# EAGLE design v0.3.0 (EAGLE 9.2.0)

## Sheet 1 of 2: Interface
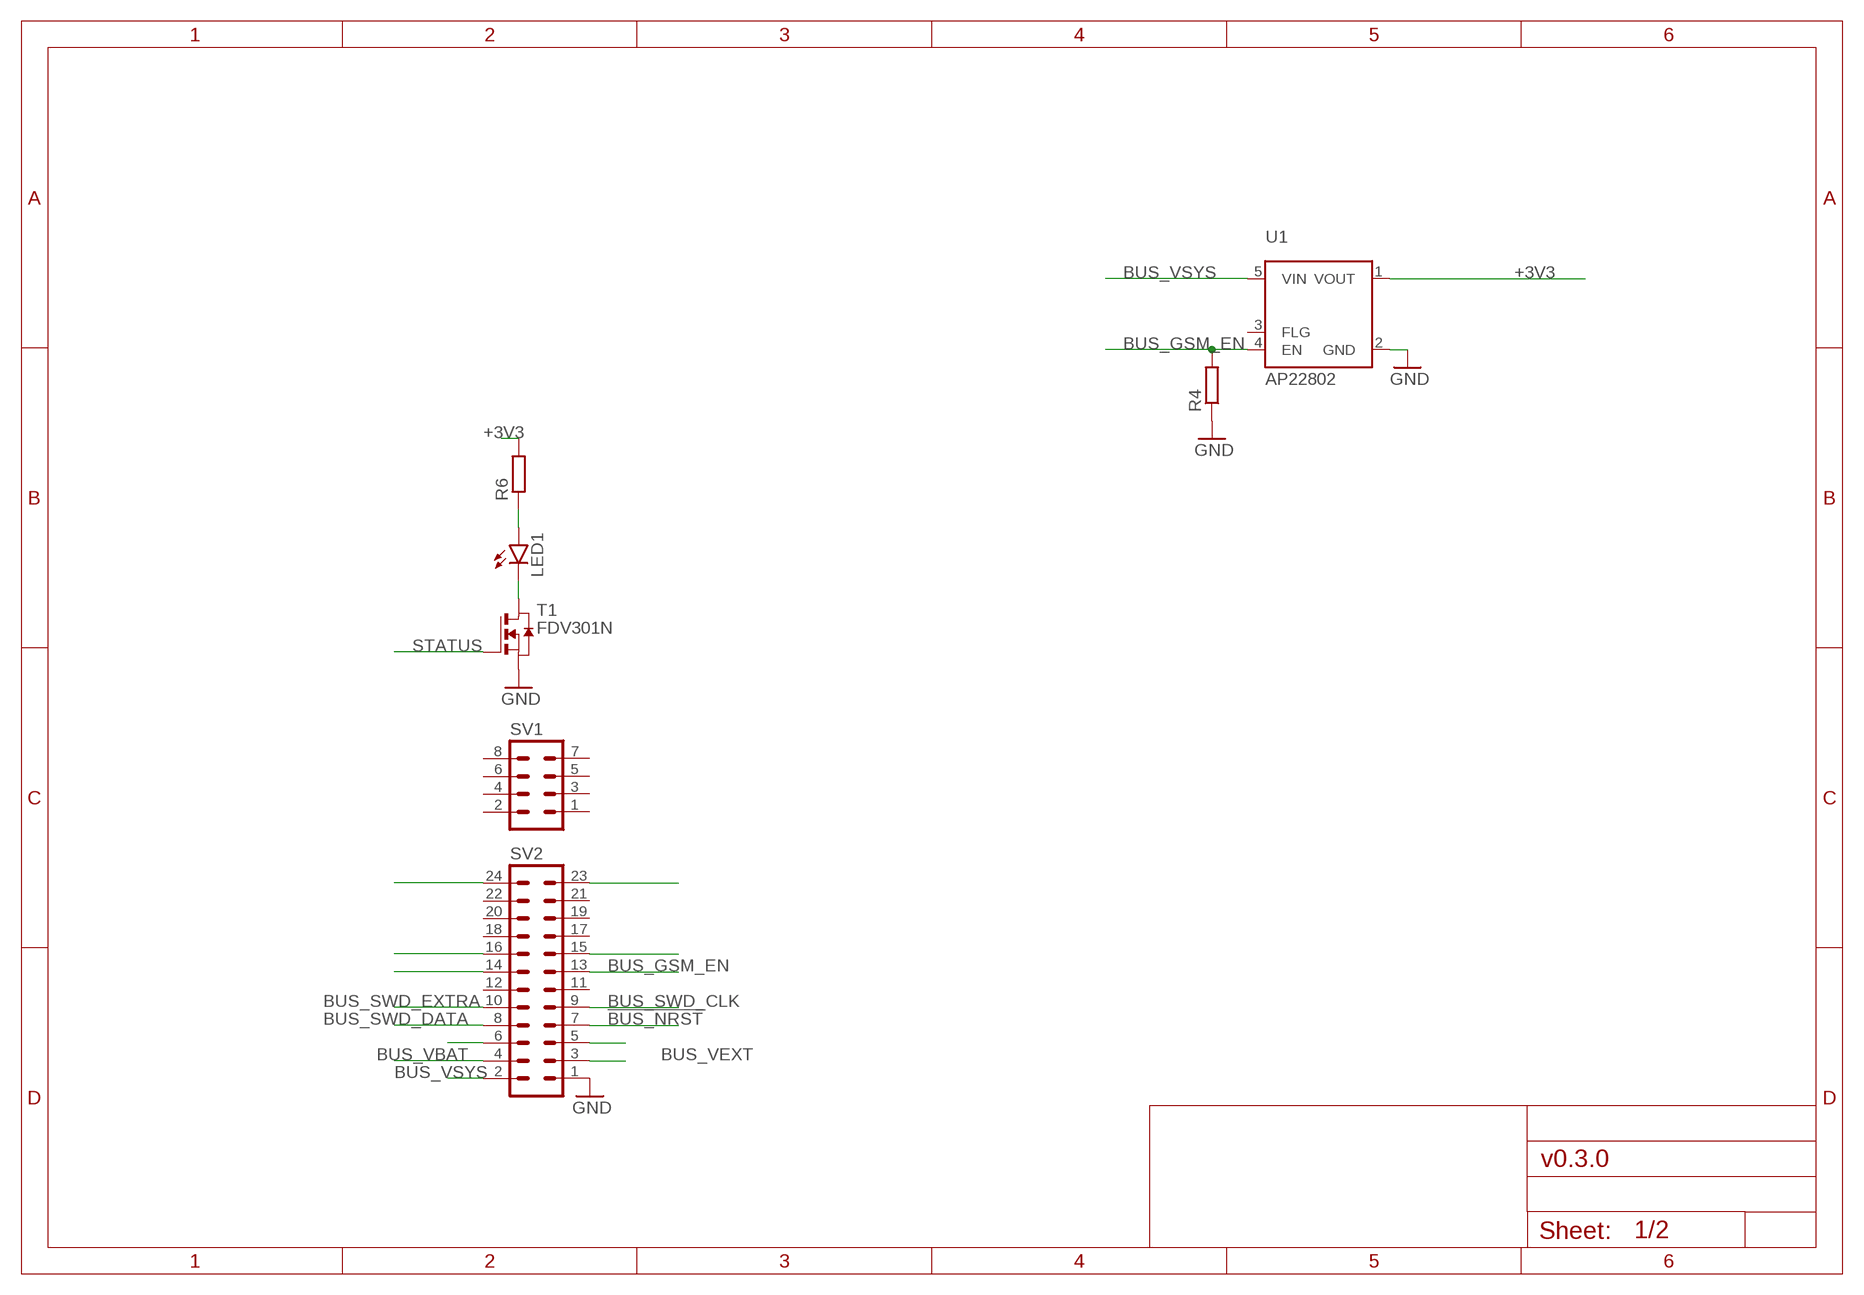
[diagram p0: schematic, sheet 1]

### Parts
LED1  LEDCHIP-LED0603  [CHIP-LED0603]
R4  R-EU_R0402  [R0402]
R6  R-EU_R0402  [R0402]
SV1  MA04-2  [MA04-2]
SV2  MA12-2  [MA12-2]
T1  FDV301N  NMOSSOT23  [SOT-23]
U1  AP22802  [SOT25]

### Nets
!BUS_NRST: SV2.7
+3V3: R6.2 U1.1(VOUT) ; also sheet 2
BUS_GSM_EN: R4.2 SV2.13 U1.4(EN)
BUS_SWD_CLK: SV2.9
BUS_SWD_DATA: SV2.8
BUS_SWD_EXTRA: SV2.10
BUS_VBAT: SV2.4
BUS_VEXT: SV2.3
BUS_VSYS: SV2.2 U1.5(VIN)
GND: R4.1 SV2.1 T1.2(S) U1.2(GND) ; also sheet 2
N$2: SV2.15
N$3: SV2.14
N$6: LED1.C T1.1(D)
N$8: SV2.16
N$12: LED1.A R6.1
N$13: SV2.23
N$14: SV2.24
N$24: SV2.5
N$25: SV2.6
STATUS: T1.3(G) ; also sheet 2
Unconnected: SV1.1 SV1.2 SV1.3 SV1.4 SV1.5 SV1.6 SV1.7 SV1.8 SV2.11 SV2.12 SV2.17 SV2.18 SV2.19 SV2.20 SV2.21 SV2.22 U1.3(FLG)

## Sheet 2 of 2: GSM modem
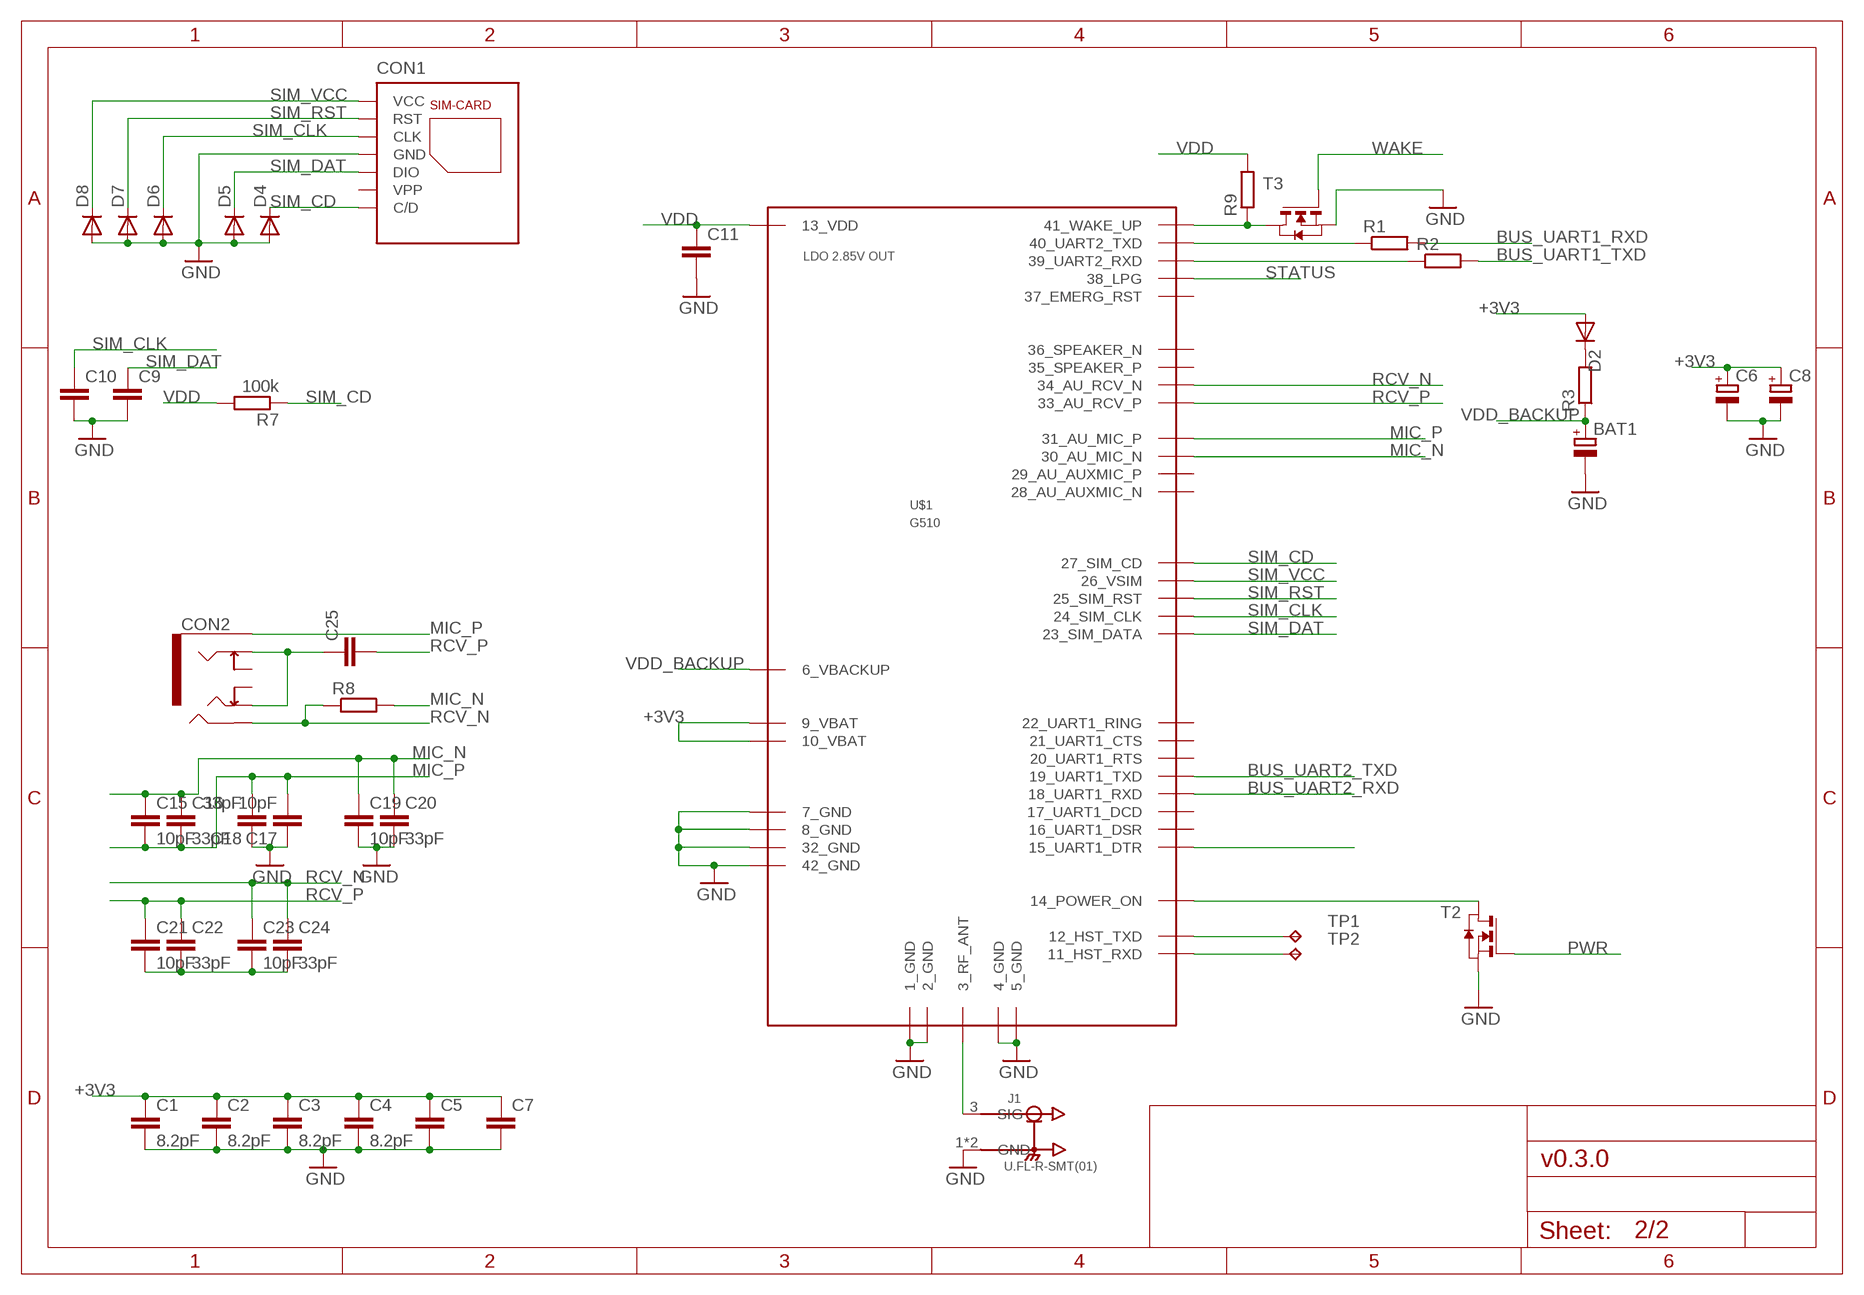
[diagram p1: schematic, sheet 2]

### Parts
BAT1  DCK-3R3E224U-E  [621]
C1  8.2pF  C-EUC0402  [C0402]
C2  8.2pF  C-EUC0402  [C0402]
C3  8.2pF  C-EUC0402  [C0402]
C4  8.2pF  C-EUC0402  [C0402]
C5  C-EUC0603  [C0603]
C6  CPOL-EUSMCC  [SMC_C]
C7  C-EUC0603  [C0603]
C8  CPOL-EUSMCC  [SMC_C]
C9  C-EUC0402  [C0402]
C10  C-EUC0402  [C0402]
C11  C-EUC0402  [C0402]
C15  10pF  C-EUC0402  [C0402]
C16  33pF  C-EUC0402  [C0402]
C17  10pF  C-EUC0402  [C0402]
C18  33pF  C-EUC0402  [C0402]
C19  10pF  C-EUC0402  [C0402]
C20  33pF  C-EUC0402  [C0402]
C21  10pF  C-EUC0402  [C0402]
C22  33pF  C-EUC0402  [C0402]
C23  10pF  C-EUC0402  [C0402]
C24  33pF  C-EUC0402  [C0402]
C25  C-EUC0603  [C0603]
CON1  115Q-BCA0  [115Q]
CON2  1503-21  [150321]
D2  DIODE-SOD323-R  [SOD323-R]
D4  DIODE-SOD323-R  [SOD323-R]
D5  DIODE-SOD323-R  [SOD323-R]
D6  DIODE-SOD323-R  [SOD323-R]
D7  DIODE-SOD323-R  [SOD323-R]
D8  DIODE-SOD323-R  [SOD323-R]
J1  U.FL-R-SMT(01)  [HRS_U.FL-R-SMT(01)]
R1  R-EU_R0402  [R0402]
R2  R-EU_R0402  [R0402]
R3  R-EU_R0402  [R0402]
R7  100k  R-EU_R0402  [R0402]
R8  R-EU_R0402  [R0402]
R9  R-EU_R0402  [R0402]
T2  NMOSSOT23  [SOT-23]
T3  NMOSSOT23  [SOT-23]
TP1  TPB1,27  [B1,27]
TP2  TPB1,27  [B1,27]
U$1  G510  [G510]

### Nets
+3V3: C1.1 C2.1 C3.1 C4.1 C5.1 C6.+ C7.1 C8.+ D2.A U$1.9_VBAT U$1.10_VBAT ; also sheet 1
BUS_UART1_RXD: R1.2
BUS_UART1_TXD: R2.2
BUS_UART2_RXD: U$1.18_UART1_RXD
BUS_UART2_TXD: U$1.19_UART1_TXD
GND: BAT1.- C1.2 C2.2 C3.2 C4.2 C5.2 C6.- C7.2 C8.- C9.2 C10.2 C11.2 C17.1 C18.1 C19.2 C20.2 CON1.GND1(GND) CON1.GND2(GND) CON1.GND3(GND) CON1.GND4(GND) CON1.P5(GND) D4.A D5.A D6.A D7.A D8.A J1.1(GND) J1.2(GND) T2.2(S) T3.2(S) U$1.1_GND U$1.2_GND U$1.4_GND U$1.5_GND U$1.7_GND U$1.8_GND U$1.32_GND U$1.42_GND ; also sheet 1
MIC_N: C15.1 C16.1 C19.1 C20.1 R8.2 U$1.30_AU_MIC_N
MIC_P: C15.2 C16.2 C17.2 C18.2 CON2.1 U$1.31_AU_MIC_P
N$1: C21.2 C22.2 C23.2 C24.2
N$4: J1.3(SIG) U$1.3_RF_ANT
N$5: U$1.15_UART1_DTR
N$7: R9.1 T3.1(D) U$1.41_WAKE_UP
N$10: R1.1 U$1.40_UART2_TXD
N$11: R2.1 U$1.39_UART2_RXD
N$16: T2.1(D) U$1.14_POWER_ON
N$17: TP1.TP U$1.12_HST_TXD
N$18: TP2.TP U$1.11_HSTRXD(11_HST_RXD)
N$20: D2.C R3.2
N$21: C25.1 CON2.3 CON2.5
PWR: T2.3(G)
RCV_N: C23.1 C24.1 CON2.2 R8.1 U$1.34_AU_RCV_N
RCV_P: C21.1 C22.1 C25.2 U$1.33_AU_RCV_P
SIM_CD: CON1.CD(C/D) D4.C R7.1 U$1.27_SIM_CD
SIM_CLK: C10.1 CON1.P3(CLK) D6.C U$1.24_SIM_CLK
SIM_DAT: C9.1 CON1.P7(DIO) D5.C U$1.23_SIM_DATA
SIM_RST: CON1.P2(RST) D7.C U$1.25_SIM_RST
SIM_VCC: CON1.P1(VCC) D8.C U$1.26_VSIM
STATUS: U$1.38_LPG ; also sheet 1
VDD: C11.1 R7.2 R9.2 U$1.13_VDD
VDD_BACKUP: BAT1.+ R3.1 U$1.6_VBACKUP
WAKE: T3.3(G)
Unconnected: CON1.P6(VPP) CON2.4 CON2.6 U$1.16_UART1_DSR U$1.17_UART1_DCD U$1.20_UART1_RTS U$1.21_UART1_CTS U$1.22_UART1_RING U$1.28_AU_AUXMIC_N U$1.29_AU_AUXMIC_P U$1.35_SPEAKER_P U$1.36_SPEAKER_N U$1.37_EMERG_RST

## Library data of the parts
BAT1 = elna:DCK-3R3E224U-E
C1-C5 C7 C9-C11 C15-C25 = rcl:C-EU: CAPACITOR, European symbol; SPICEPREFIX: C
C6 C8 = rcl:CPOL-EU: POLARIZED CAPACITOR, European symbol; SPICEPREFIX: C
CON1 = parts-attend:115Q-BCA0
CON2 = lumberg:1503-21
D2 D4-D8 = diode:DIODE-: DIODE
J1 = U.FL-R-SMT_01_:U.FL-R-SMT(01): U.FL Series 6 Ghz 50 Ohm Ultra-small SMT Coaxial Cable Receptacle; AVAILABILITY: Unavailable; DESCRIPTION: U.FL Series 6 Ghz 50 Ohm Ultra-small SMT Coaxial Cable Receptacle; MF: Hirose; MP: U.FL-R-SMT_01_; PACKAGE: None; PRICE: None
LED1 = led:LED: LED OSRAM: - CHIPLED LG R971, LG N971, LY N971, LG Q971, LY Q971, LO R971, LY R971 LH N974, LH R974 LS Q976, LO Q976, LY Q976 LO Q996 - Hyper CHIPLED LW Q18S LB Q993, LB Q99A, LB R99A - SideLED LS A670, LO A670, LY A670, LG A670, LP A670 LB A673, LV A673, LT A673, LW A673 LH A674 LY A675 LS A676, LA A676, LO A676, LY A676, LW A676 LS A679, LY A679, LG A679 - Hyper Micro SIDELED® LS Y876, LA Y876, LO Y876, LY Y876 LT Y87S - SmartLED LW L88C, LW L88S LB L89C, LB L89S, LG L890 LS L89K, LO L89K, LY L89K LS L896, LA L896, LO L896, LY L896 - TOPLED LS T670, LO T670, LY T670, LG T670, LP T670 LSG T670, LSP T670, LSY T670, LOP T670, LYG T670 LG T671, LOG T671, LSG T671 LB T673, LV T673, LT T673, LW T673 LH T674 LS T676, LA T676, LO T676, LY T676, LB T676, LH T676, LSB T676, LW T676 LB T67C, LV T67C, LT T67C, LS T67K, LO T67K, LY T67K, LW E67C LS E67B, LA E67B, LO E67B, LY E67B, LB E67C, LV E67C, LT E67C LW T67C LS T679, LY T679, LG T679 LS T770, LO T770, LY T770, LG T770, LP T770 LB T773, LV T773, LT T773, LW T773 LH T774 LS E675, LA E675, LY E675, LS T675 LS T776, LA T776, LO T776, LY T776, LB T776 LHGB T686 LT T68C, LB T68C - Hyper Mini TOPLED® LB M676 - Mini TOPLED Santana® LG M470 LS M47K, LO M47K, LY M47K Source: http://www.osram.convergy.de LUXEON: - LUMILED® LXK2-PW12-R00, LXK2-PW12-S00, LXK2-PW14-U00, LXK2-PW14-V00 LXK2-PM12-R00, LXK2-PM12-S00, LXK2-PM14-U00 LXK2-PE12-Q00, LXK2-PE12-R00, LXK2-PE12-S00, LXK2-PE14-T00, LXK2-PE14-U00 LXK2-PB12-K00, LXK2-PB12-L00, LXK2-PB12-M00, LXK2-PB14-N00, LXK2-PB14-P00, LXK2-PB14-Q00 LXK2-PR12-L00, LXK2-PR12-M00, LXK2-PR14-Q00, LXK2-PR14-R00 LXK2-PD12-Q00, LXK2-PD12-R00, LXK2-PD12-S00 LXK2-PH12-R00, LXK2-PH12-S00 LXK2-PL12-P00, LXK2-PL12-Q00, LXK2-PL12-R00 Source: www.luxeon.com KINGBRIGHT: KA-3528ASYC Source: www.kingbright.com
R1-R4 R6-R9 = rcl:R-EU_: RESISTOR, European symbol; SPICEPREFIX: R
SV1 = con-lstb:MA04-2: PIN HEADER; OC_FARNELL: unknown; OC_NEWARK: unknown
SV2 = con-lstb:MA12-2: PIN HEADER; OC_FARNELL: unknown; OC_NEWARK: unknown
T1-T3 = zetex:NMOSSOT23: MOS FET; OC_FARNELL: unknown; OC_NEWARK: unknown
TP1 TP2 = testpad:TP: Test pad
U1 = parts-diodes:AP22802
U$1 = parts-fibocom:G510

## Net classes
1 50_feed: width 1 mm, clearance 0.4 mm
2 usb_dif: width 0.4 mm, clearance 0.8 mm

## Board
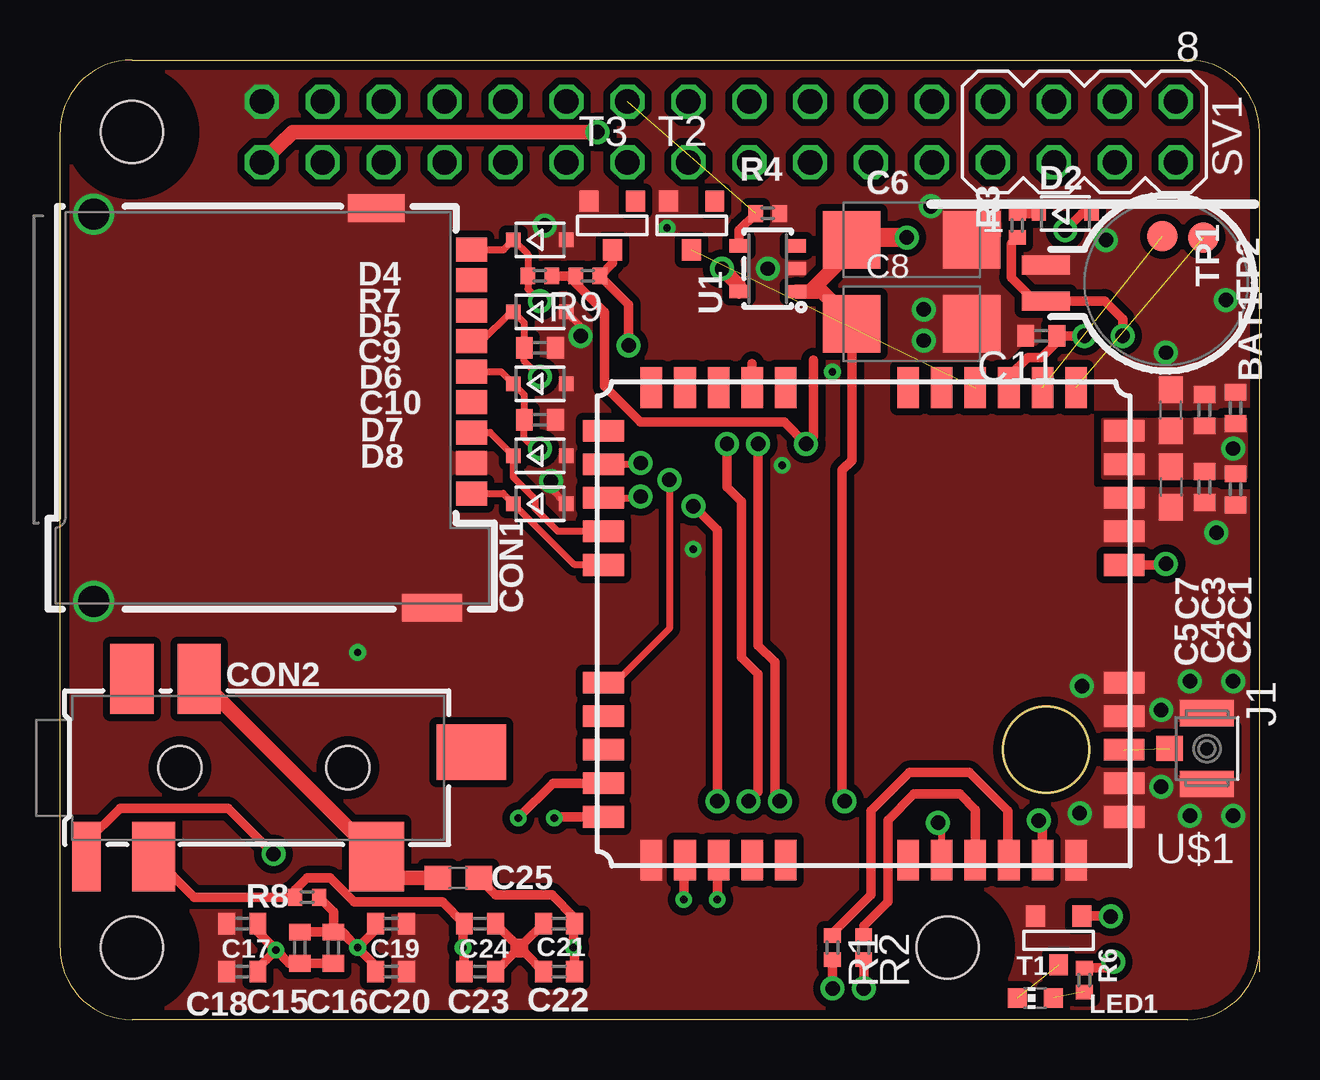
[diagram p2: board, top side]
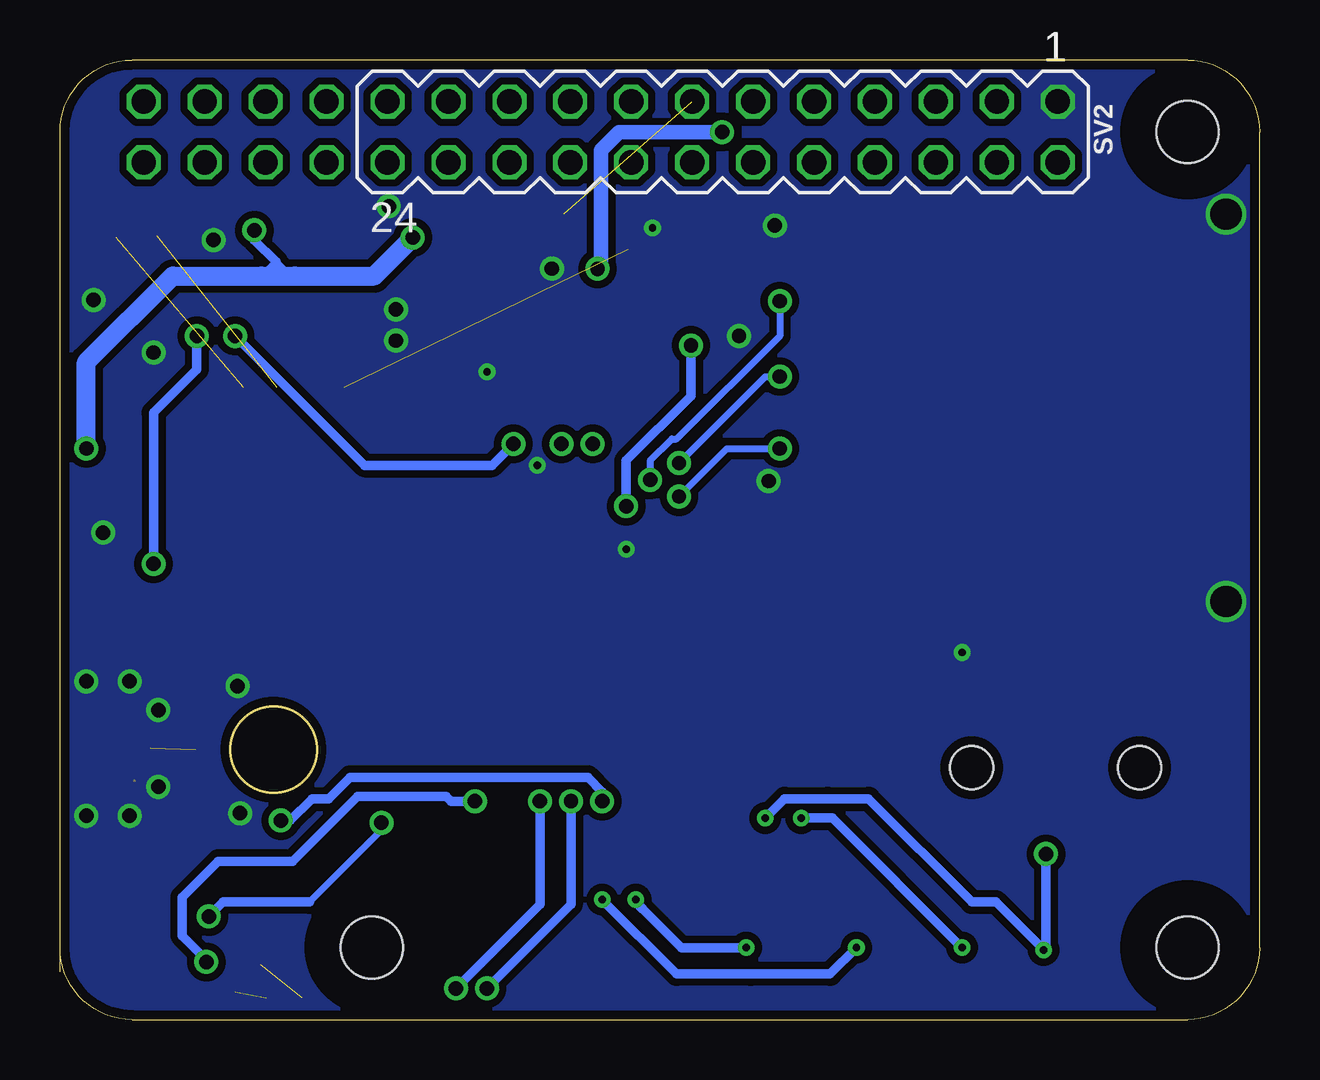
[diagram p3: board, bottom side, seen from below]

Size 50 x 40 mm. Coordinates in mm from the lower left corner, seen from the top.
Outline: 50,2 50,3
Outline: 50,3 arc-90 47,0 3,0 arc-90 0,3 0,37 arc-90 3,40 47,40 arc-90 50,37 50,3
Copper layers (1*16): Top 0.035mm / dielectric 0.53mm / Bottom 0.035mm
Design rules "default *": minimum track width 0.2mm, minimum drill 0.3mm, track to track 0.2mm, track to pad 0.2mm, pad to pad 0.2mm, via to via 0.2mm, smd to smd 6mil, copper to edge 0.4mm, drill to drill 0.2mm, minimum pad ring 0.2mm, minimum via ring 0.2mm, stop-mask expansion 0.1mm, vias tented up to drill 0mil, thermal gap 10mil
Holes 2.6 mm at 3,37 3,3 37,3
tRestrict: area 0.5,34.5 to 5.5,39.5; area 0.5,0.5 to 5.5,5.5; area 34.5,0.5 to 39.5,5.5
bRestrict: area 0.5,34.5 to 5.5,39.5; area 0.5,0.5 to 5.5,5.5; area 34.5,0.5 to 39.5,5.5

### Footprints (pad centres in the part's own frame; a part is rotated, then mirrored left to right if it is on the bottom)
621 = smd 0.8 x 2: + 0.75,-1.6; - -0.75,-1.6
C0402 = smd 0.7 x 0.9: 1 -0.65,0; 2 0.65,0
C0603 = smd 1.1 x 1: 1 -0.85,0; 2 0.85,0
SMC_C = smd 2.4 x 2.4: + -2.5,0; - 2.5,0
115Q = smd 1 x 1.3: CD -6.59,0.65; P1 3.57,0.65; P2 1.03,0.65; P3 -1.51,0.65; P4 -4.05,0.65; P5 2.3,0.65; P6 -0.24,0.65; P7 -2.78,0.65; P8 -5.32,0.65 | smd 1.15 x 2.35: GND1 -8.325,-3.32 | smd 1.15 x 2.5: GND2 8.325,-1 | drill 1.3: GND3 -8.07,-15.1; GND4 8.07,-15.1
150321 = smd 1.2 x 2.9: 1 3.9,3.7 | smd 1.8 x 2.9: 2 1.1,3.7; 5 -0.8,-3.7; 6 2,-3.7 | smd 2.3 x 2.9: 3 -8.2,3.7 | smd 2.9 x 2.3: 4 -12.15,-0.65 | hole 1.8: 0,0; -7,0
SOD323-R = smd 0.6 x 0.6: A 1.1,0; C -1.1,0
HRS_U.FL-R-SMT(01) = smd 1.1 x 2.25: 1 -1.475,0; 2 1.475,0 | smd 1.05 x 1.1: 3 0,-1.55
CHIP-LED0603 = smd 0.8 x 0.8: A 0,-0.75; C 0,0.75
R0402 = smd 0.6 x 0.7: 1 -0.5,0; 2 0.5,0
MA04-2 = drill 1.016 octagon: 1 -3.81,-1.27; 2 -3.81,1.27; 3 -1.27,-1.27; 4 -1.27,1.27; 5 1.27,-1.27; 6 1.27,1.27; 7 3.81,-1.27; 8 3.81,1.27
MA12-2 = drill 1.016 octagon: 1 -13.97,-1.27; 2 -13.97,1.27; 3 -11.43,-1.27; 4 -11.43,1.27; 5 -8.89,-1.27; 6 -8.89,1.27; 7 -6.35,-1.27; 8 -6.35,1.27; 9 -3.81,-1.27; 10 -3.81,1.27; 11 -1.27,-1.27; 12 -1.27,1.27; 13 1.27,-1.27; 14 1.27,1.27; 15 3.81,-1.27; 16 3.81,1.27; 17 6.35,-1.27; 18 6.35,1.27; 19 8.89,-1.27; 20 8.89,1.27; 21 11.43,-1.27; 22 11.43,1.27; 23 13.97,-1.27; 24 13.97,1.27
SOT-23 = smd 0.787 x 0.889: 1 0.025,-1.016; 2 -0.94,1.016; 3 0.991,1.016
B1,27 = smd 1.27 x 1.27: TP 0,0
SOT25 = smd 0.55 x 0.8: 1 -0.95,-1.2; 2 0,-1.2; 3 0.95,-1.2; 4 0.95,1.2; 5 -0.95,1.2
G510 = smd 0.9 x 1.7: 1_GND -8.05,-10.85; 2_GND -6.65,-10.85; 3_RF_ANT -5.25,-10.85; 4_GND -3.85,-10.85; 5_GND -2.45,-10.85; 6_VBACKUP 2.45,-10.85; 7_GND 3.85,-10.85; 8_GND 5.25,-10.85; 9_VBAT 6.65,-10.85; 10_VBAT 8.05,-10.85; 22_UART1_RING 8.05,10.85; 23_SIM_DATA 6.65,10.85; 24_SIM_CLK 5.25,10.85; 25_SIM_RST 3.85,10.85; 26_VSIM 2.45,10.85; 27_SIM_CD -2.45,10.85; 28_AU_AUXMIC_N -3.85,10.85; 29_AU_AUXMIC_P -5.25,10.85; 30_AU_MIC_N -6.65,10.85; 31_AU_MIC_P -8.05,10.85 | smd 1.7 x 0.9: 11_HSTRXD 9.85,-8.85; 12_HST_TXD 9.85,-7.45; 13_VDD 9.85,-6.05; 14_POWER_ON 9.85,-4.65; 15_UART1_DTR 9.85,-3.25; 16_UART1_DSR 9.85,-1.85; 17_UART1_DCD 9.85,3.25; 18_UART1_RXD 9.85,4.65; 19_UART1_TXD 9.85,6.05; 20_UART1_RTS 9.85,7.45; 21_UART1_CTS 9.85,8.85; 32_GND -9.85,8.85; 33_AU_RCV_P -9.85,7.45; 34_AU_RCV_N -9.85,6.05; 35_SPEAKER_P -9.85,4.65; 36_SPEAKER_N -9.85,3.25; 37_EMERG_RST -9.85,-1.85; 38_LPG -9.85,-3.25; 39_UART2_RXD -9.85,-4.65; 40_UART2_TXD -9.85,-6.05; 41_WAKE_UP -9.85,-7.45; 42_GND -9.85,-8.85

### Placement (x,y rotation side)
BAT1  42.7,30.7 270 top
C1  49,25.5 90 top
C2  49,22.1 270 top
C3  47.7,25.4 90 top
C4  47.7,22.2 270 top
C5  46.3,22.2 270 top
C6  35.5,32.5 0 top
C7  46.3,25.4 90 top
C8  35.5,29 0 top
C9  20,28 0 top
C10  20,25 0 top
C11  40.9,28.5 180 top
C15  10,3 270 top
C16  11.4,3 270 top
C17  7.6,4 0 top
C18  7.6,2 0 top
C19  13.8,4 0 top
C20  13.8,2 0 top
C21  20.8,2 180 top
C22  20.8,4 180 top
C23  17.5,2 0 top
C24  17.5,4 0 top
C25  16.6,5.9 0 top
CON1  16.5,25.5 270 top
CON2  5,10.5 180 top
D2  41.9,33.6 0 top
D4  20,32.5 0 top
D5  20,29.5 0 top
D6  20,26.5 0 top
D7  20,23.5 0 top
D8  20,21.5 0 top
J1  47.8,11.3 270 top
LED1  40.65,0.9 90 top
R1  32.2,3 270 top
R2  33.5,3 270 top
R3  39.9,33.1 90 top
R4  29.5,33.6 180 top
R6  42.7,1.65 90 top
R7  20,31 0 top
R8  10.3,5.1 0 top
R9  22,31 180 top
SV1  42.7,37 0 top
SV2  22.38,37 180 bottom
T1  41.6,3.3 0 top
T2  26.3,33.1 0 top
T3  23,33.1 0 top
TP1  45.95,32.65 0 top
TP2  47.65,32.6 0 top
U1  29.5,31.3 90 top
U$1  33.5,16.5 90 top

### Tracks (layer width: path | path; a pad name or v marks a point on that pad's centre or on a via)
+3V3  (via drill 0.6)
  Top 0.4: C8.+ 33,23.3 32.6,22.9 32.6,9.2 v32.7,9.1 | v43.9,2.4 43.65,2.15 R6.2 | v41.9,32.9 42.6,33.6 D2.A
  Top 0.6: C6.+ 33,32.1 31.25,30.35 U1.1 31.75,30.35 33,29.1 C8.+
  Top 0.8: v35.3,32.6 33.1,32.6 C6.+
  Bottom 0.3: 41,31.6 41,31 | 41,31.6 41.6,31 | 41,31.6 40.4,31 40.2,31
  Bottom 0.4: v32.7,9.1 33.7,9.1 33.9,9.3 37.6,9.3 40.3,6.6 43.4,6.6 44.9,5.1 44.9,3.5 43.9,2.5 v43.9,2.4 | 41,31.6 41.9,32.5 v41.9,32.9
  Bottom 0.8: v48.9,23.8 48.9,27.4 45.3,31 41.6,31 41,31 40.2,31 36.9,31 v35.3,32.6
  pour Top (no thermals): 43.5,25 48.6,25 48.7,25.1 49.3,25.1 49.4,25 49.4,22.6 49.3,22.5 48.7,22.5 48.6,22.6 43.5,22.6
BUS_GSM_EN  (1 unrouted)
  Top 0.4: U1.4 28.3,32.9 R4.2
BUS_UART1_RXD  (via drill 0.6)
  Top 0.4: R1.2 v32.2,1.3 | v28.7,9.1 29.1,9.5 29.1,14.4 28.4,15.1 28.4,21.6 27.8,22.2 v27.8,24
  Bottom 0.4: v32.2,1.3 28.7,4.8 v28.7,9.1
BUS_UART1_TXD  (via drill 0.6)
  Top 0.4: R2.2 v33.5,1.3 | v30,9.1 30,9.2 29.8,9.4 29.8,14.9 29.1,15.6 v29.1,24
  Bottom 0.4: v33.5,1.3 30,4.8 v30,9.1
BUS_UART2_RXD
  Top 0.4: U$1.18_UART1_RXD 28.85,27.35
BUS_VSYS  (via drill 0.6)
  Top 0.6: SV2.2 9.38,36.7 9.4,36.7 9.7,37 v22.4,37 | v27.59,31.29 28.3,30.59 U1.5
  Bottom 0.6: v22.4,37 26.7,37 27.45,36.25 27.45,31.43 v27.59,31.29
GND  (via drill 0.3, 0.6)
  Top 0.3: D8.A 20.46,22.14 v20.46,22.45 | D5.A 21.7,28.9 v21.7,28.5
  other vias: 20.2,33.1 29.5,31.3 36,28.3 36,29.6 36.3,33.9 43.6,32.5 46.1,27.8 48.6,30 48.2,20.3 48.9,14.1 47.1,14.1 45.9,12.9 42.6,13.9 42.5,8.6 45.9,9.7 48.9,8.5 47.1,8.5 26.4,19.6 32.2,27 30.1,23.1 25.3,33 12.4,15.3
  pour Top (isolate 0.3, rank 6, no thermals): -1,41 51,41 51,-1 -1,-1
  pour Bottom (isolate 0.3, rank 6, no thermals): -2,42 -2,-2 52,-2 52,42
MIC_N  (via drill 0.3)
  Top 0.4: C15.1 C16.1 | C20.1 13.15,2.25 v12.4,3 | v12.4,3 12.1,3.3 11.75,3.65 C16.1 | C19.1 13.15,3.75 v12.4,3 | C16.1 11.4,4.5 R8.2 | U$1.30_AU_MIC_N 20.55,9.85 v19.1,8.4
  Bottom 0.4: v19.1,8.4 17.8,8.4 v12.4,3
MIC_P  (via drill 0.3, 0.6)
  Top 0.4: v9,2.9 9.55,2.35 C15.2 C16.2 | v9,2.9 8.7,3.2 8.25,3.65 C17.2 | C18.2 8.25,2.15 8.6,2.5 | 8.6,2.5 v9,2.9 | CON2.1 1.1,7.4 2.5,8.8 7,8.8 v8.9,6.9 | v9,2.9 8.6,2.5 | U$1.31_AU_MIC_P 20.65,8.45 v20.6,8.4
  Bottom 0.4: v8.9,6.9 8.9,5.7 8.9,3.7 8.9,3 v9,2.9 11,4.9 12,4.9 16.3,9.2 18,9.2 19.8,9.2 v20.6,8.4
N$1
  Top 0.4: C21.2 19.38,2.77 | 19.38,2.77 19.02,3.12 | 19.02,3.12 18.82,3.33 | 18.82,3.33 C24.2 | C23.2 18.93,2.77 | 18.93,2.77 19.32,3.17 | 19.32,3.17 C22.2 | 19.02,3.12 19.27,3.12 19.32,3.17 | 19.32,3.17 19.32,2.83 19.38,2.77 | 19.38,2.77 18.98,2.77 | 18.98,2.77 18.93,2.77 | 18.98,3.17 18.98,2.77 | 18.82,3.33 18.98,3.17 | 18.98,3.17 19.32,3.17
N$4  (1 unrouted)
N$6  (1 unrouted)
N$7  (via drill 0.6)
  Top 0.4: U$1.41_WAKE_UP 40.95,8.15 v40.8,8.3 | T3.1 23.02,31.52 R9.1 23.7,29.8 v23.7,28.1 | v26.4,21.4 27.4,20.4 27.4,18.6 v27.4,9.1
  Bottom 0.4: v40.8,8.3 40.4,8.3 39.5,9.2 38.8,9.2 37.9,10.1 28,10.1 27.4,9.5 v27.4,9.1 | v23.7,28.1 23.7,26 26.4,23.3 v26.4,21.4
N$10
  Top 0.4: U$1.40_UART2_TXD 39.5,6.7 39.5,8.7 37.9,10.3 35.4,10.3 33.8,8.7 33.8,5.2 32.2,3.6 R1.1
N$11
  Top 0.4: U$1.39_UART2_RXD 38.15,8.75 37.5,9.4 35.6,9.4 34.5,8.3 34.5,4.9 33.5,3.9 R2.1
N$12  (1 unrouted)
N$16  (1 unrouted)
N$17  (1 unrouted)
N$18  (1 unrouted)
N$20
  Top 0.4: R3.2 D2.C
N$21
  Top 0.6: CON2.5 CON2.3 14.1,5.9 C25.1
RCV_N  (via drill 0.3)
  Top 0.4: CON2.2 5.6,5.1 R8.1 9.8,5.4 10.3,5.9 11.25,5.9 12.25,4.9 15.95,4.9 C24.1 16.8,3.95 v16.8,3 16.85,2.95 C23.1 | v27.4,5 27.4,6.6 U$1.34_AU_RCV_N
  Bottom 0.4: v16.8,3 17.9,1.9 21.2,1.9 24.3,1.9 v27.4,5
RCV_P  (via drill 0.3)
  Top 0.4: C25.2 18.15,5.2 19.7,5.2 20.5,5.2 21.45,4.25 C22.1 21.4,3.95 v21.4,3 21.45,2.95 C21.1 | v26,5 26,6.6 U$1.33_AU_RCV_P
  Bottom 0.4: v21.4,3 24.1,3 25.7,4.6 26,4.9 v26,5
SIM_CD  (via drill 0.6)
  Top 0.3: CON1.CD 18.49,32.09 D4.C 19.5,31.9 R7.1 19.5,30.45 v20,29.95 | v25.4,22.5 25.4,16.3 23.15,14.05 U$1.27_SIM_CD
  Bottom 0.3: v20,29.95 20,28.5 24.3,24.2 24.5,24.2 25.4,23.3 v25.4,22.5
SIM_CLK  (via drill 0.6)
  Top 0.3: CON1.P3 18.39,27.01 D6.C 19.35,26.05 C10.1 19.35,24.25 19.8,23.8 v20,23.8 | U$1.24_SIM_CLK 24.15,21.75 v24.2,21.8
  Bottom 0.3: v24.2,21.8 22.2,23.8 v20,23.8
SIM_DAT  (via drill 0.6)
  Top 0.3: CON1.P7 17.58,28.28 18.8,29.5 D5.C 19.35,29.05 C9.1 19.35,27.45 v20,26.8 | U$1.23_SIM_DATA 24.15,23.15 v24.2,23.2
  Bottom 0.3: v24.2,23.2 20.6,26.8 v20,26.8
SIM_RST
  Top 0.3: CON1.P2 17.93,24.47 D7.C 18.9,22.6 19.8,21.7 19.8,21.31 20.76,20.35 U$1.25_SIM_RST
SIM_VCC
  Top 0.3: CON1.P1 18.47,21.93 D8.C 21.45,18.95 U$1.26_VSIM
STATUS  (via drill 0.6)
  Top 0.3: U$1.38_LPG 36.75,8.05 v36.6,8.2
  Top 0.4: v43.8,4.3 43.78,4.32 T1.3
  Bottom 0.3: v36.6,8.2 36.6,7.9 39.6,4.9
  Bottom 0.4: 39.6,4.9 43.2,4.9 v43.8,4.3
VDD  (via drill 0.6)
  Top 0.4: U$1.13_VDD 39.55,26.82 40.33,27.6 40.9,27.6 41.55,28.25 C11.1 v42.7,28.5 | 21.2,31 21.4,31 R9.2 | 21.2,31 R7.2 | 21.2,31 22.7,29.5 22.7,26.4 24.2,24.9 30.2,24.9 v31.1,24 31.4,24.3 31.4,27.5
  Bottom 0.4: v42.7,28.5 37.3,23.1 32,23.1 v31.1,24
VDD_BACKUP  (via drill 0.6)
  Top 0.4: U$1.6_VBACKUP 46.05,18.95 v46.1,19 | R3.1 39.65,32.35 39.65,30.93 40.63,29.95 BAT1.+ 43.55,29.95 44.3,29.2 v44.3,28.5
  Bottom 0.4: v46.1,19 46.1,25.3 44.3,27.1 v44.3,28.5